# EAGLE schematic Ferrofluid Speaker v22 (EAGLE 9.7.0)
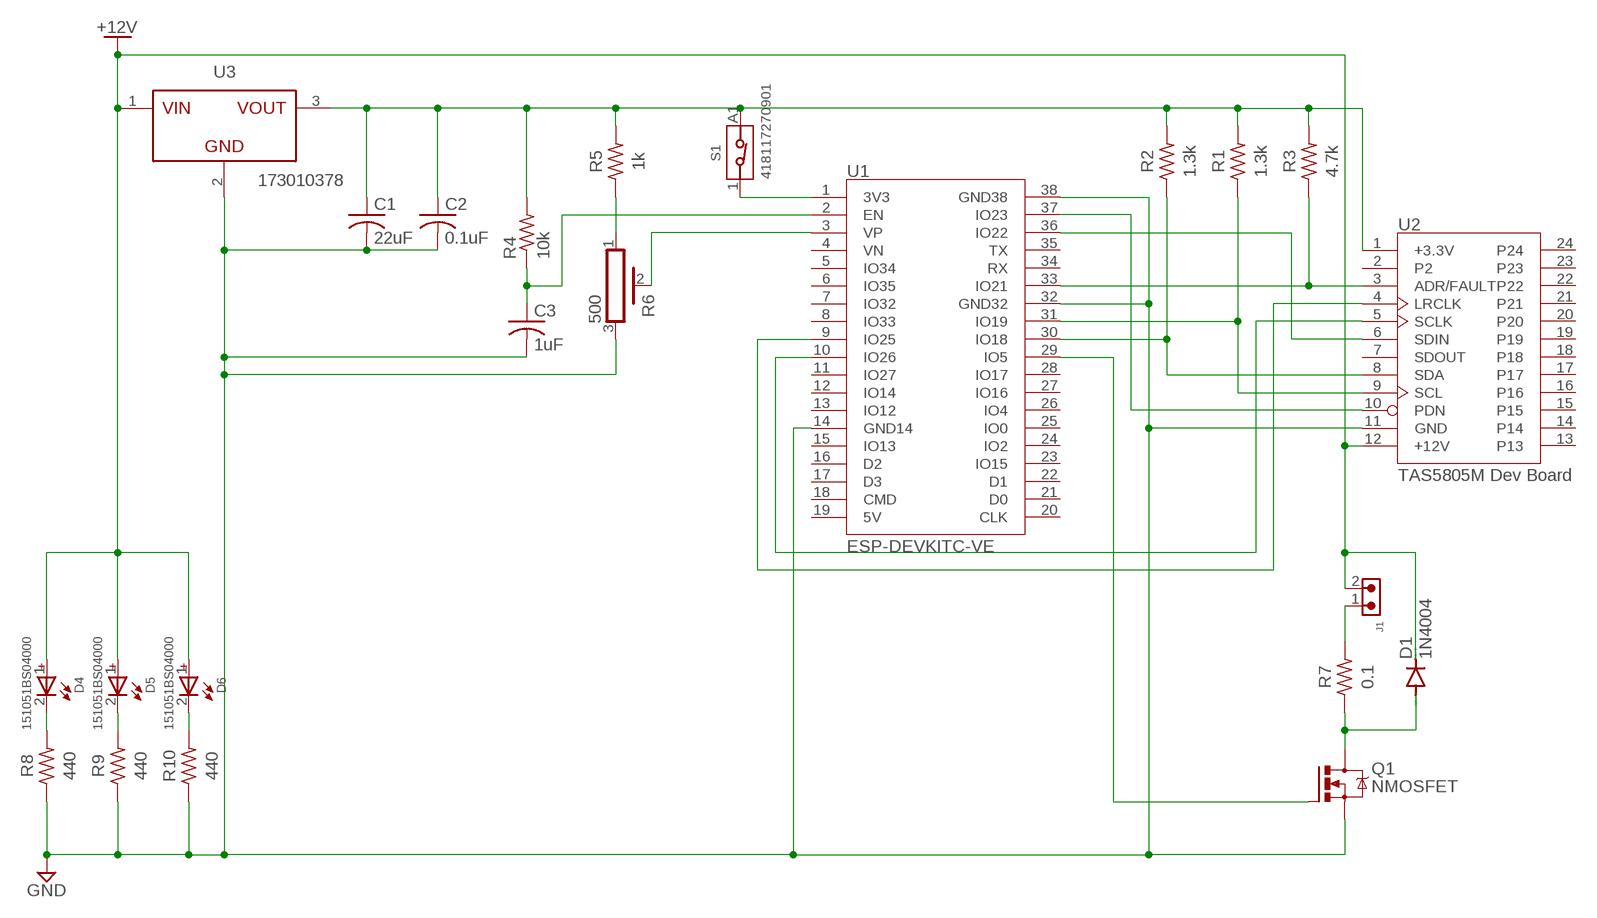
[diagram p0: schematic, sheet 1]

## Parts
C1  22uF  C-US025-024X044  [C025-024X044]
C2  0.1uF  C-US025-024X044  [C025-024X044]
C3  1uF  C-US025-024X044  [C025-024X044]
D1  1N4004  [DO41-10]
D4  151051BS04000  WL-TMRC_5MM_151051BS04000_WITHOUTSTOPPER  [WL-TMRC_5MM]
D5  151051BS04000  WL-TMRC_5MM_151051BS04000_WITHOUTSTOPPER  [WL-TMRC_5MM]
D6  151051BS04000  WL-TMRC_5MM_151051BS04000_WITHOUTSTOPPER  [WL-TMRC_5MM]
J1  6490XX11122_64900211122  [64900211122]
Q1  NMOSFET  NMOSFET_TO220  [TO220BV]
R1  1.3k  R-US_AXIAL-7.2MM-PITCH  [RESAD724W46L381D178B]
R2  1.3k  R-US_AXIAL-7.2MM-PITCH  [RESAD724W46L381D178B]
R3  4.7k  R-US_AXIAL-7.2MM-PITCH  [RESAD724W46L381D178B]
R4  10k  R-US_0204/5  [0204/5]
R5  1k  R-US_AXIAL-7.2MM-PITCH  [RESAD724W46L381D178B]
R6  500  PV36Z  [PV36Z]
R7  0.1  R-US_AXIAL-7.2MM-PITCH  [RESAD724W46L381D178B]
R8  440  R-US_AXIAL-7.2MM-PITCH  [RESAD724W46L381D178B]
R9  440  R-US_AXIAL-7.2MM-PITCH  [RESAD724W46L381D178B]
R10  440  R-US_AXIAL-7.2MM-PITCH  [RESAD724W46L381D178B]
S1  418117270901  [418117270901]
U1  ESP-DEVKITC-VE  ESP32-DEVKITC-VE  [ESP32-DEVKITC-VE]
U2  TAS5805M Dev Board  TAS5805M_DEV  [TAS5805M_DEV]
U3  173010378  MAGI³C-FDSM_SIP-3_173010378_173010X78  [MAGI³C-FDSM_173010X78]

## Nets
+3.3V: C1.1 C2.1 R1.2 R2.2 R3.2 R4.2 R5.2 S1.A1 U2.1(+3.3V) U3.3(VOUT)
+12V: D1.C D4.1(+) D5.1(+) D6.1(+) J1.2 U2.12(+12V) U3.1(VIN)
ADR/FAULT: R3.1 U1.33(IO21) U2.3(ADR/FAULT)
GND: C1.2 C2.2 C3.2 Q1.S R6.3 R8.1 R9.1 R10.1 U1.14(GND14) U1.32(GND32) U1.38(GND38) U2.11(GND) U3.2(GND)
LRCLK: U1.9(IO25) U2.4(LRCLK)
MAGLEFT: Q1.G U1.29(IO5)
N$1: C3.1 R4.1 U1.2(EN)
N$2: D1.A Q1.D R7.1
N$5: S1.1 U1.1(3V3)
N$6: R5.1 R6.1
N$7: R6.2 U1.3(VP)
N$8: J1.1 R7.2
N$9: D4.2(-) R8.2
N$10: D5.2(-) R9.2
N$11: D6.2(-) R10.2
PDN: U1.37(IO23) U2.10(PDN)
SCL: R1.1 U1.31(IO19) U2.9(SCL)
SCLK: U1.10(IO26) U2.5(SCLK)
SDA: R2.1 U1.30(IO18) U2.8(SDA)
SDIN: U1.36(IO22) U2.6(SDIN)
Unconnected: U1.4(VN) U1.5(IO34) U1.6(IO35) U1.7(IO32) U1.8(IO33) U1.11(IO27) U1.12(IO14) U1.13(IO12) U1.15(IO13) U1.16(D2) U1.17(D3) U1.18(CMD) U1.20(CLK) U1.21(D0) U1.22(D1) U1.23(IO15) U1.24(IO2) U1.25(IO0) U1.26(IO4) U1.27(IO16) U1.28(IO17) U1.34(RX) U1.35(TX) U2.2 U2.7(SDOUT) U2.13 U2.14 U2.15 U2.16 U2.17 U2.18 U2.19 U2.20 U2.21 U2.22 U2.23 U2.24

## Power pins joined to a net without a drawn wire
5V: U1.19(5V)

## Library data of the parts
C1-C3 = rcl:C-US: CAPACITOR, American symbol; SPICEPREFIX: C
D1 = Diode:1N4004: DIODE general purpose rectifier, 1 A
D4-D6 = Wurth_LEDs_WL-TMRC:WL-TMRC_5MM: WL-TMRC THT Mono-color Round Color Characteristics Low energy consumption High reliability Low current requirement Fast switching No UV/IR radiation Easy installation LED without stopper Variety of lens colors Variety of viewing angle Applications Status light Light guide design Commercial advertising Decorative lighting Interior and exterior lighting Outdoor LED panels Instrumentation and front panel indicator Traffic signal light Electronic and communication appliance Toys <https://www.we-online.com/catalog/media/o64621v209%20Family_WL_TMRC_THT.jpg> Details see: www.we-online.com/katalog/WL-TMRC <www.we-online.com/catalog/WL-TMRC/?utm_source=eagle_model&utm_medium=description_link&utm_campaign=eisos_eagle> Updated by Ella Wu, 2022-06-21 2022(C) Wurth Elektronik; CHIP-TECHNOLOGY: GaN; DATASHEET-URL: https://www.we-online.com/redexpert/spec/151051BS04000?ae; DOMINANT-WAVELENGTH: 470nm; EMITTING-COLOR: Blue; FORWARD-VOLTAGE: 3.2V; LUMINOUS-INTENSITY: 500mcd; MOUNT: THT; PART-NUMBER: 151051BS04000; PEAK-WAVELENGTH: 465nm; VIEWING-ANGLE: 40°
J1 = Wurth_Connectors_WR-MPC4:6490XX11122_64900211122: WR- MPC4 4.20 mm Male Single Row Vertical Header KIND PROPERTIES: Pitch:4.2 mm Gender:Male MATERIAL PROPERTIES: Insulator Material :PA66 Insulator Flammability Rating:UL94 V-0 Insulator Color:White Contact Material:Copper Alloy Contact Plating:Tin Contact Type:Stamped GENERAL INFORMATION Operating Temperature:-40 up to +105 °C Working Voltage:600V (AC) Withstanding Voltage:1500 V (AC) Contact Resistance:10 mΩ RISO:1000 MΩ PACKAGING PROPERTIES Packaging:Tray <https://katalog.we-online.com/media/images/v2/o33185v209%20Family_WR-MPC4_6490xx11122.jpg> Details see: https://katalog.we-online.com/en/em/MPC4_4_20_MALE_SINGLE_ROW_VERTICAL_HEADER_6490XX11122 Updated by Yingchun,Shan 2019-11-12 2019 (C) Würth Elektronik; CONTACT-RESISTANCE: 10mOhm; DATASHEET-URL: https://www.we-online.com/catalog/datasheet/64900211122.pdf; GENDER: Male; L: 9.6mm; MATE-WITH: WR-MPC4 4.20 mm Female Single Row Plug; MOUNT: THT; PACKAGING: Tray; PART-NUMBER: 64900211122; PCB-CABLE-PANEL: PCB; PINS: 2; PITCH: 4.2mm; ROWS: Single; TOL-R: max.; TYPE: Vertical; WORKING-VOLTAGE: 600V(AC)
Q1 = Transistor:NMOSFET: N-Channel MOSFET - Generic; CATEGORY: Transistor; SUB-CATEGORY: MOSFET; TYPE: N-Channel
R1-R3 R5 R7-R10 = Resistor:R-US: Resistor Fixed - ANSI; CATEGORY: Resistor; SUB-CATEGORY: Fixed
R4 = rcl:R-US_: RESISTOR, American symbol; SPICEPREFIX: R
R6 = Resistor:PV36: Rectangular Trimmer Potentiometers - PV36 Series Datasheet <https://www.bourns.com/docs/Product-Datasheets/pv36.pdf>; CATEGORY: Resistor; DESCRIPTION: Lead Sealed Type Multiturn PV36 Series; MANUFACTURER: BOURNS; MPN: PV36Z; OPERATING_TEMPERATURE: -55 to +125 °C; PART_STATUS: Active; ROHS_COMPLIANCE: RoHS Compliant; SERIES: PV36; SUB-CATEGORY: Trimpot; TYPE: Lead Sealed
S1 = Wurth_Switch_WS-DITV:418117270901: WS-DITV Compact THT with Raised Actuator 2.54 mm Mechanical Properties Operation Force:800 g Electrical Life:2000 Cycles Actuator Type:Raise Type Properties IR:25 mA VR:24 V (DC) IR:100 mA VR:50 V (DC) Contact Resistance Initial:50 mΩ Contact Resistance After Life Test:100 mΩ RISO:100 MΩ Withstanding Voltage:500 V (AC) Actuator Type:Raise Type Switch Position:Off Material Properties Cover Material:PBT Cover Flammability Rating:UL94 V-0 Cover Color:Red Base Material:PBT Base Flammability Rating:UL94 V-0 Base Color:Black Actuator Material:PBT Actuator Flammability Rating:UL94 V-0 Actuator Color:White Contact Material:Copper Alloy Contact Plating:Gold Terminal Material:Copper Alloy Terminal Plating:Gold General Information Operating Temperature:-40 up to +85 °C Packaging Properties Packaging:Tube <https://www.we-online.com/catalog/media/o60896v209%20DITV_418117270908A_gruppe.jpg> Details see: https://www.we-online.com/catalog/en/DITV_2_54_COMPACT_THT_WITH_RAISED_ACTUATOR/ Updated by Yingchun, Shan 2020-01-22 2020 (C) Würth Elektronik; DATASHEET-URL: https://www.we-online.com/catalog/datasheet/418117270901.pdf; PART-NUMBER: 418117270901; PINS: 1; QTY: 130
U1 = Adam Part Library:ESP32-DEVKITC-VE
U2 = Adam Part Library:TAS5805M_DEV
U3 = Wurth_Step Down Converter_MagI³C-FDSM:MAGI³C-FDSM_SIP-3: MagI³C-FDSM Fixed Step Down Regulator Module Characteristics Simplest design (no power supply knowledge required) Leaded through-hole package for easy manufacturing and prototyping Stand alone solution (CIN and COUT integrated, no external components) L78x series linear regulator replacement (no heatsink required) Low conducted and radiated EMI (compliant to EN55022 class B) Applications Point-of-Load from 24V, 18V, 15V, 12V, 9V rail Replacement for linear regulators Interface and microcontroller supply Industrial, Test & Measurement, Medical applications System power supplies <https://www.we-online.com/catalog/media/o55808v209%20Family_FDSM_NEU.jpg> Details see: https://www.we-online.com/catalog/en/MAGIC_FDSM_FIXED_OUTPUT_VOLTAGE Updated by Ella Wu 2022-01-21 2022 (C) Würth Elektronik; DATASHEET-URL: https://www.we-online.de/katalog/datasheet/173010378.pdf; HEIGHT: 10.5mm; I-OUTPUT: 1A; LENGTH: 11.6mm; MOUNT: THT; PART-NUMBER: 173010378; V-INPUT: 7 - 28V; V-OUTPUT: 3.3V; WIDTH: 8.5mm